# EasyEDA schematic Audrino_7Seg_2020-07-23_17-01-29.json
TITLE: Sheet_2; REV: 1.0; Date: 2020-07-08; Sheet: 1/1; Drawn By: gapadmanaban.gap; Company: Your Company
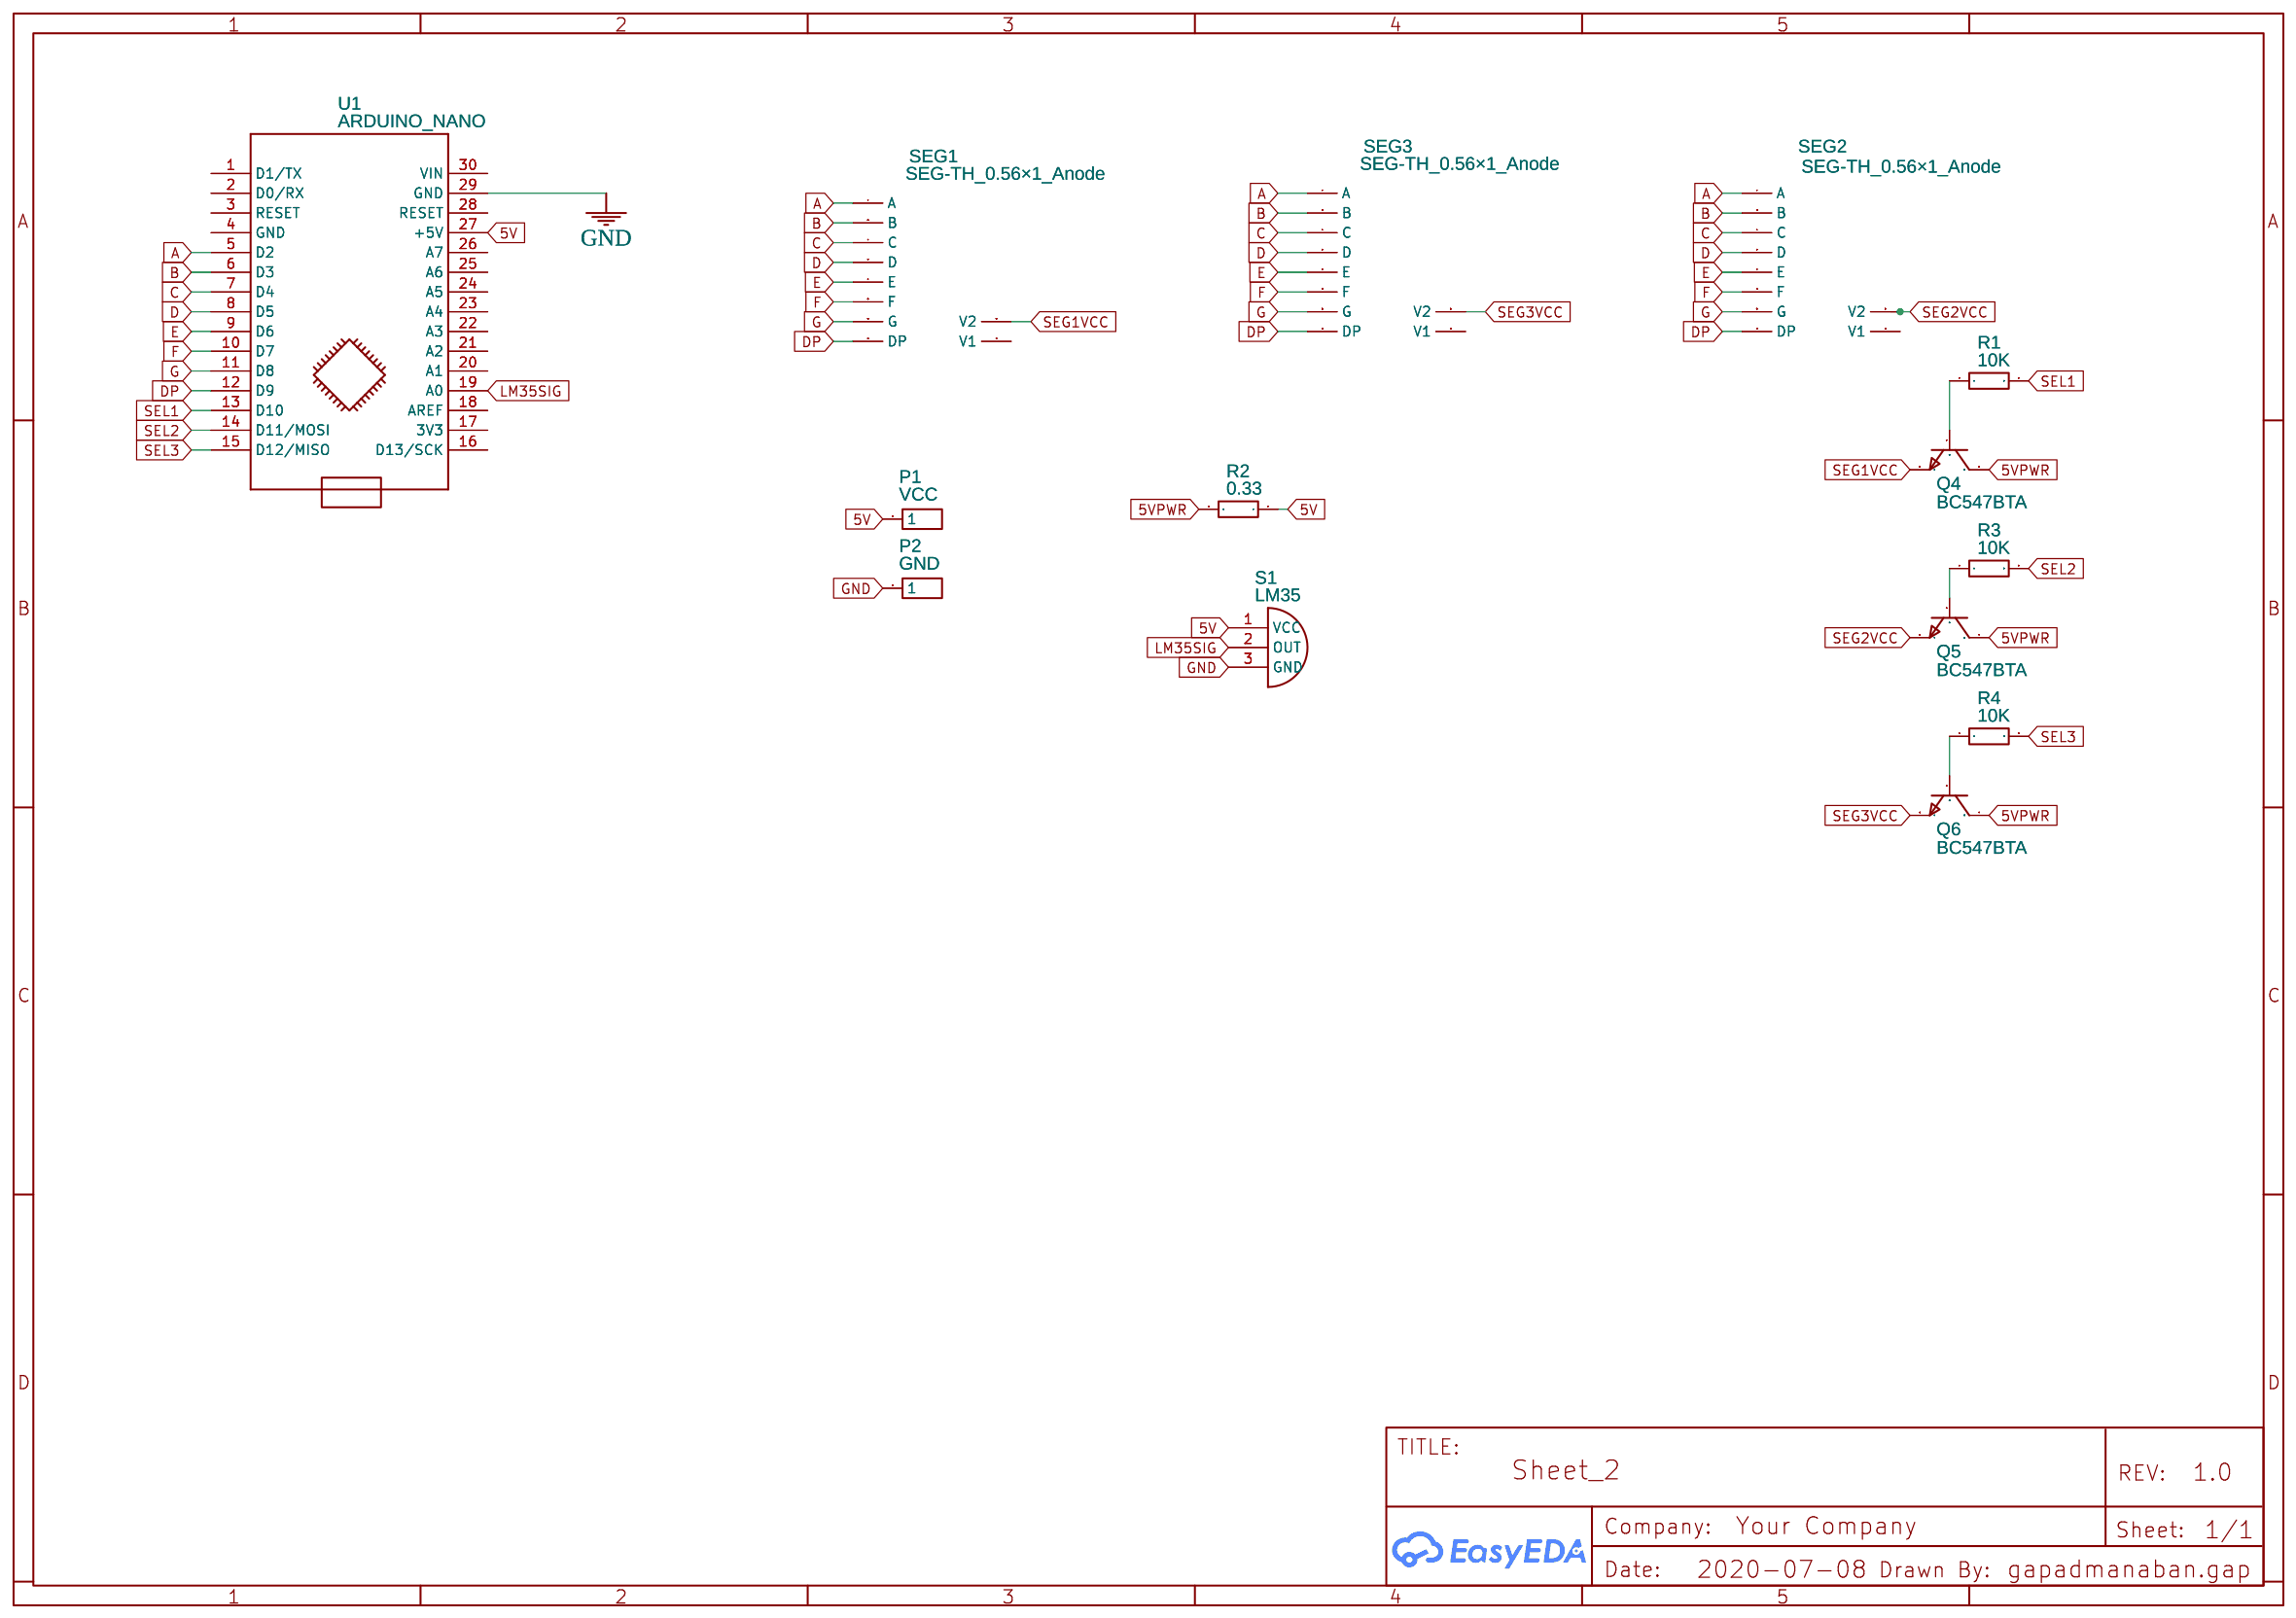
[diagram p0: schematic sheet]

## Parts
P1  VCC  [HDR-TH_1P-P2.54-V-M]
P2  GND  [HDR-TH_1P-P2.54-V-M]
Q4  BC547BTA  [TO-92-3_L4.8-W3.7-P2.54-L]
Q5  BC547BTA  [TO-92-3_L4.8-W3.7-P2.54-L]
Q6  BC547BTA  [TO-92-3_L4.8-W3.7-P2.54-L]
R1  10K  [RES-TH_BD4.5-L11.0-P15.00-D0.7]
R2  0.33  [RES-TH_BD4.5-L11.0-P15.00-D0.7]
R3  10K  [RES-TH_BD4.5-L11.0-P15.00-D0.7]
R4  10K  [RES-TH_BD4.5-L11.0-P15.00-D0.7]
S1  LM35  [LM35]
SEG1  SEG-TH_0.56×1_Anode  [LED-SEG-TH_10P-L12.6-W19.0-P2.54-S15.24-BL]
SEG2  SEG-TH_0.56×1_Anode  [LED-SEG-TH_10P-L12.6-W19.0-P2.54-S15.24-BL]
SEG3  SEG-TH_0.56×1_Anode  [LED-SEG-TH_10P-L12.6-W19.0-P2.54-S15.24-BL]
U1  ARDUINO_NANO  [ARDUINO_NANO]

## Library data of the parts
P1 P2 = Header-Male-2.54_1x1: Supplier: LCSC; Manufacturer: ReliaPro; Supplier Part: C81276
Q4-Q6 = BC547BTA: Supplier: LCSC; Supplier Part: C258144; Manufacturer: ON Semicon; Contributor: LCSC
R1 R3 R4 = MO2WS-0R33±5%-6T63: Supplier: LCSC; Supplier Part: C479460; Manufacturer: FlyWin; Contributor: LCSC
R2 = MO2WS-0R33±5%-6T63: Supplier: LCSC; Supplier Part: C479460; Manufacturer: FlyWin; Contributor: LCSC; Package Display: No
S1 = -: Manufacturer Part: ?; Contributor: pb158
SEG1-SEG3 = SEG-TH_0.56×1_Anode: Manufacturer: 志浩; Supplier Part: C8092; Supplier: LCSC; Contributor: LCEDA_01
U1 = ARDUINO_NANO: sourceId: KGSeAWhDB

## Nets
5V: P1.1 R2.1 S1.1(VCC) U1.27(+5V)
5VPWR: Q4.1(C) Q5.1(C) Q6.1(C) R2.2
GND: P2.1 S1.3(GND) U1.29(GND)
A: SEG1.7(A) SEG2.7(A) SEG3.7(A) U1.5(D2)
B: SEG1.6(B) SEG2.6(B) SEG3.6(B) U1.6(D3)
C: SEG1.4(C) SEG2.4(C) SEG3.4(C) U1.7(D4)
D: SEG1.2(D) SEG2.2(D) SEG3.2(D) U1.8(D5)
DP: SEG1.5(DP) SEG2.5(DP) SEG3.5(DP) U1.12(D9)
E: SEG1.1(E) SEG2.1(E) SEG3.1(E) U1.9(D6)
F: SEG1.9(F) SEG2.9(F) SEG3.9(F) U1.10(D7)
G: SEG1.10(G) SEG2.10(G) SEG3.10(G) U1.11(D8)
LM35SIG: S1.2(OUT) U1.19(A0)
SEG1VCC: Q4.3(E) SEG1.8(V2)
SEG2VCC: Q5.3(E) SEG2.8(V2)
SEG3VCC: Q6.3(E) SEG3.8(V2)
SEL1: R1.2 U1.13(D10)
SEL2: R3.2 U1.14(D11/MOSI)
SEL3: R4.2 U1.15(D12/MISO)
Net-(Q4-2): Q4.2(B) R1.1
Net-(Q5-2): Q5.2(B) R3.1
Net-(Q6-2): Q6.2(B) R4.1

Not connected (* = marked no-connect by the designer): SEG1 3(V1); SEG2 3(V1); SEG3 3(V1); U1 1(D1/TX) 2(D0/RX) 3(RESET) 4(GND) 16(D13/SCK) 17(3V3) 18(AREF) 20(A1) 21(A2) 22(A3) 23(A4) 24(A5) 25(A6) 26(A7) 28(RESET) 30(VIN)
